# EAGLE design SPin (EAGLE 9.4.2)
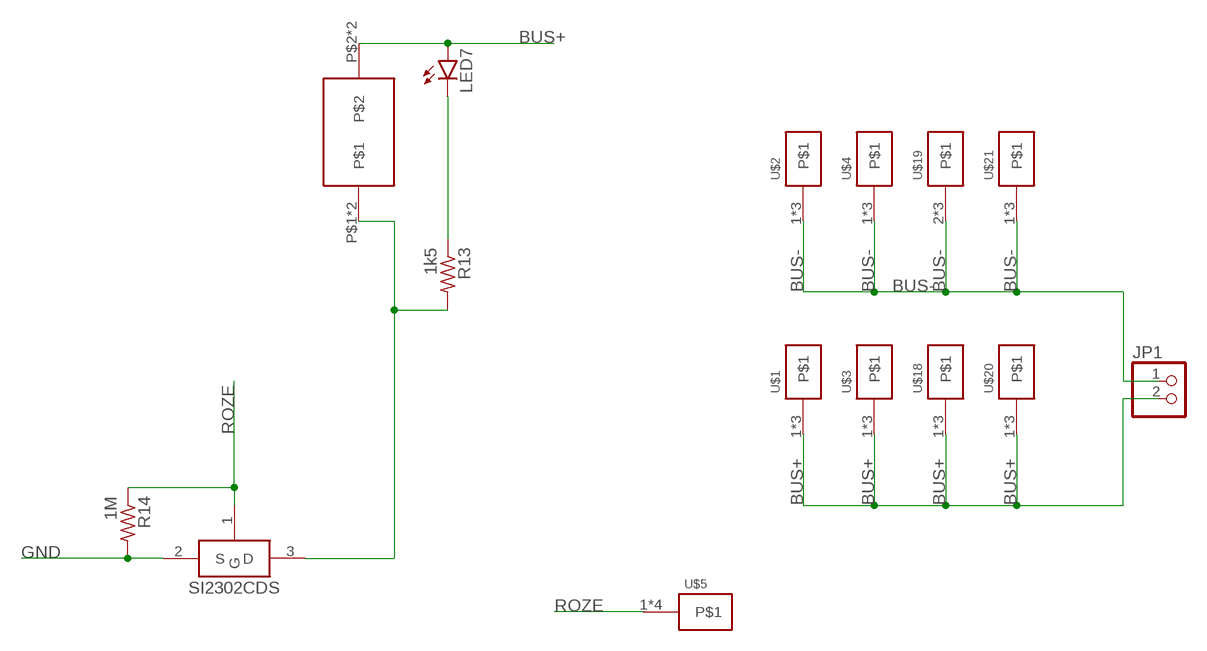
[diagram p0: schematic, sheet 1]

## Parts
JP1  PINHD-1X2  [1X02]
LED7  LEDCHIPLED_0603  [CHIPLED_0603]
R13  1k5  R-US_R0603  [R0603]
R14  1M  R-US_R0603  [R0603]
U$1  KCONNECT3  [KCONNECT-3]
U$2  KCONNECT3  [KCONNECT-3]
U$3  KCONNECT4  [KCONNECT-4]
U$4  KCONNECT4  [KCONNECT-4]
U$5  KCONNECTQUAD-  [KCONNECT-_QUAD]
U$6  GRAFITGRAFIT4_2  [GRAFIT4_2]
U$13  SI2302CDS  [SOT23-3]
U$18  KCONNECT4  [KCONNECT-4]
U$19  KCONNECT1  [KCONNECT-1]
U$20  KCONNECT3  [KCONNECT-3]
U$21  KCONNECT3  [KCONNECT-3]

## Nets
2: R13.2 U$6.P$1 U$6.P$4 U$13.3(D)
BUS+: JP1.2 LED7.A U$1.1 U$1.2 U$1.4 U$3.1 U$3.2 U$3.3 U$6.P$2 U$6.P$5 U$18.1 U$18.2 U$18.3 U$20.1 U$20.2 U$20.4
BUS-: JP1.1 U$2.1 U$2.2 U$2.4 U$4.1 U$4.2 U$4.3 U$19.2 U$19.3 U$19.4 U$21.1 U$21.2 U$21.4
GND: R14.2 U$13.2(S)
N$29: LED7.C R13.1
ROZE: R14.1 U$5.1 U$5.2 U$5.3 U$5.4 U$13.1(G)

## Library data of the parts
JP1 = pinhead:PINHD-1X2: PIN HEADER
LED7 = led:LED: LED OSRAM: - CHIPLED LG R971, LG N971, LY N971, LG Q971, LY Q971, LO R971, LY R971 LH N974, LH R974 LS Q976, LO Q976, LY Q976 LO Q996 - Hyper CHIPLED LW Q18S LB Q993, LB Q99A, LB R99A - SideLED LS A670, LO A670, LY A670, LG A670, LP A670 LB A673, LV A673, LT A673, LW A673 LH A674 LY A675 LS A676, LA A676, LO A676, LY A676, LW A676 LS A679, LY A679, LG A679 - Hyper Micro SIDELED® LS Y876, LA Y876, LO Y876, LY Y876 LT Y87S - SmartLED LW L88C, LW L88S LB L89C, LB L89S, LG L890 LS L89K, LO L89K, LY L89K LS L896, LA L896, LO L896, LY L896 - TOPLED LS T670, LO T670, LY T670, LG T670, LP T670 LSG T670, LSP T670, LSY T670, LOP T670, LYG T670 LG T671, LOG T671, LSG T671 LB T673, LV T673, LT T673, LW T673 LH T674 LS T676, LA T676, LO T676, LY T676, LB T676, LH T676, LSB T676, LW T676 LB T67C, LV T67C, LT T67C, LS T67K, LO T67K, LY T67K, LW E67C LS E67B, LA E67B, LO E67B, LY E67B, LB E67C, LV E67C, LT E67C LW T67C LS T679, LY T679, LG T679 LS T770, LO T770, LY T770, LG T770, LP T770 LB T773, LV T773, LT T773, LW T773 LH T774 LS E675, LA E675, LY E675, LS T675 LS T776, LA T776, LO T776, LY T776, LB T776 LHGB T686 LT T68C, LB T68C - Hyper Mini TOPLED® LB M676 - Mini TOPLED Santana® LG M470 LS M47K, LO M47K, LY M47K Source: http://www.osram.convergy.de LUXEON: - LUMILED® LXK2-PW12-R00, LXK2-PW12-S00, LXK2-PW14-U00, LXK2-PW14-V00 LXK2-PM12-R00, LXK2-PM12-S00, LXK2-PM14-U00 LXK2-PE12-Q00, LXK2-PE12-R00, LXK2-PE12-S00, LXK2-PE14-T00, LXK2-PE14-U00 LXK2-PB12-K00, LXK2-PB12-L00, LXK2-PB12-M00, LXK2-PB14-N00, LXK2-PB14-P00, LXK2-PB14-Q00 LXK2-PR12-L00, LXK2-PR12-M00, LXK2-PR14-Q00, LXK2-PR14-R00 LXK2-PD12-Q00, LXK2-PD12-R00, LXK2-PD12-S00 LXK2-PH12-R00, LXK2-PH12-S00 LXK2-PL12-P00, LXK2-PL12-Q00, LXK2-PL12-R00 Source: www.luxeon.com KINGBRIGHT: KA-3528ASYC Source: www.kingbright.com
R13 R14 = resistor:R-US_: RESISTOR, American symbol
U$1-U$5 U$18-U$21 = CanCubeSat:KCONNECT
U$6 = CanCubeSat:GRAFIT
U$13 = CanCubeSat:SI2302CDS

## Board
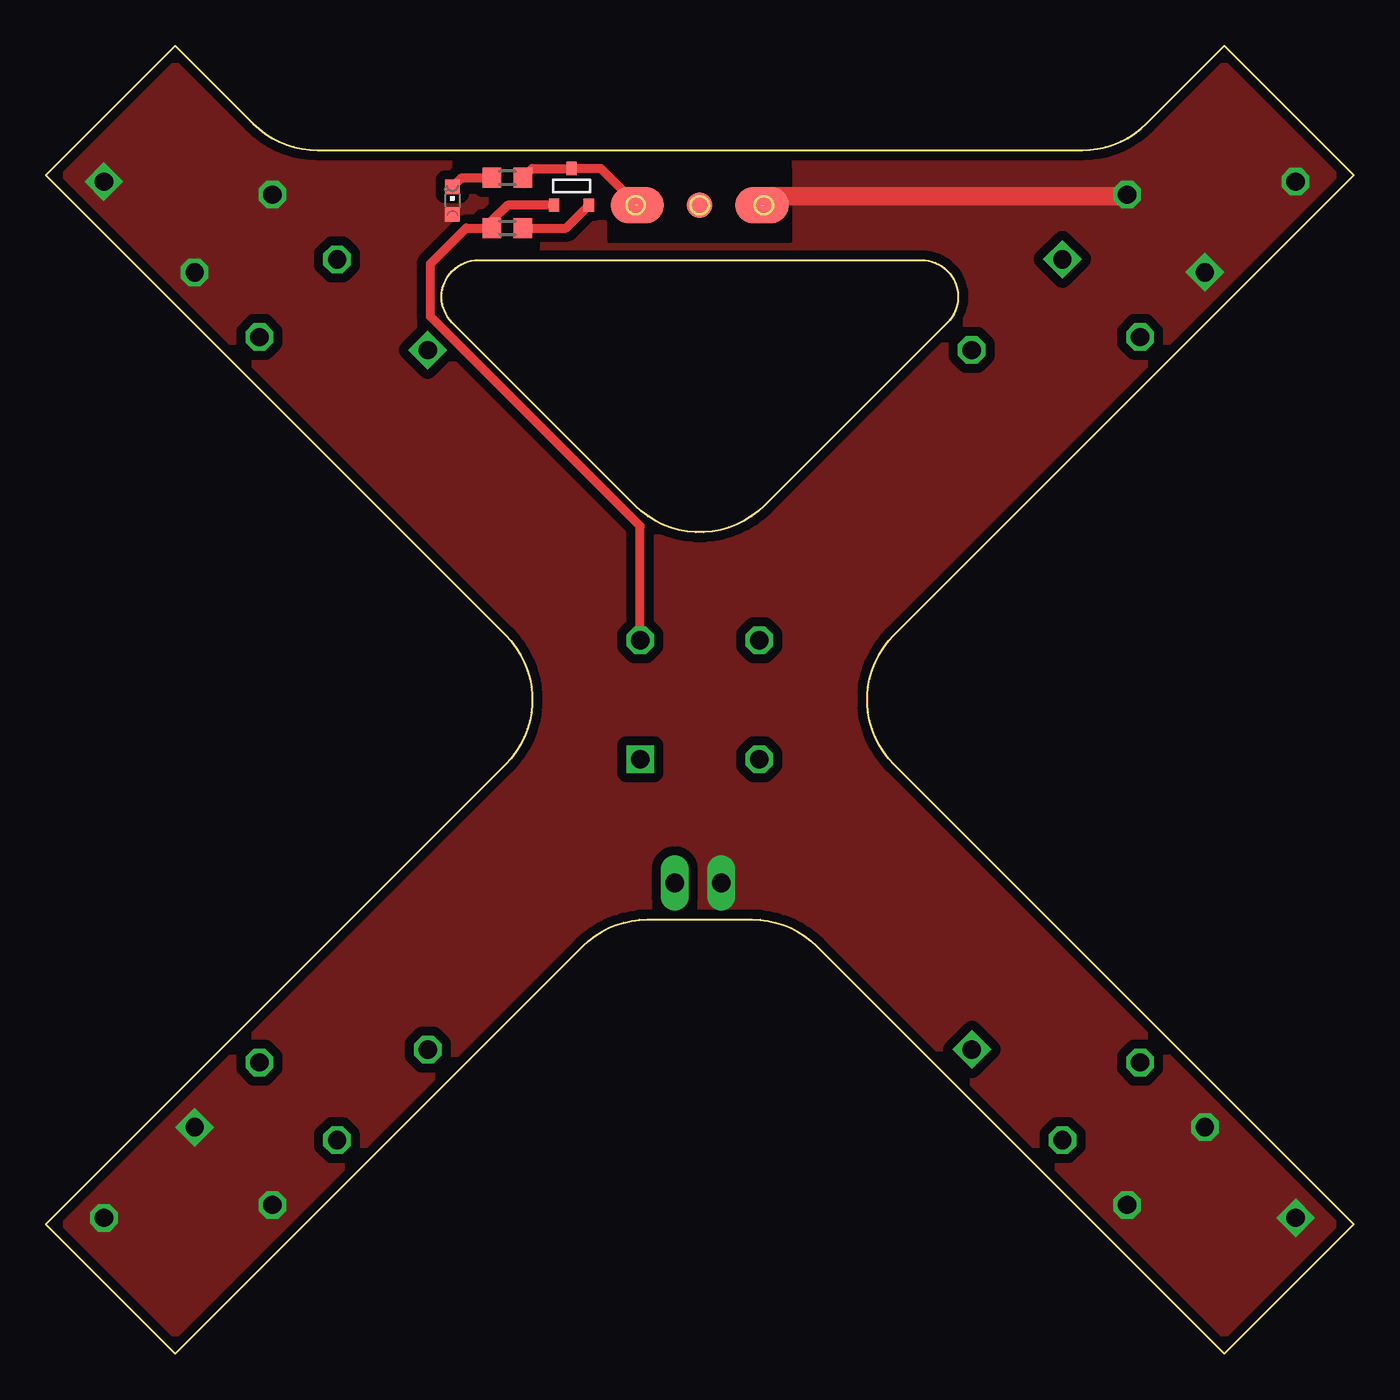
[diagram p1: board, top side]
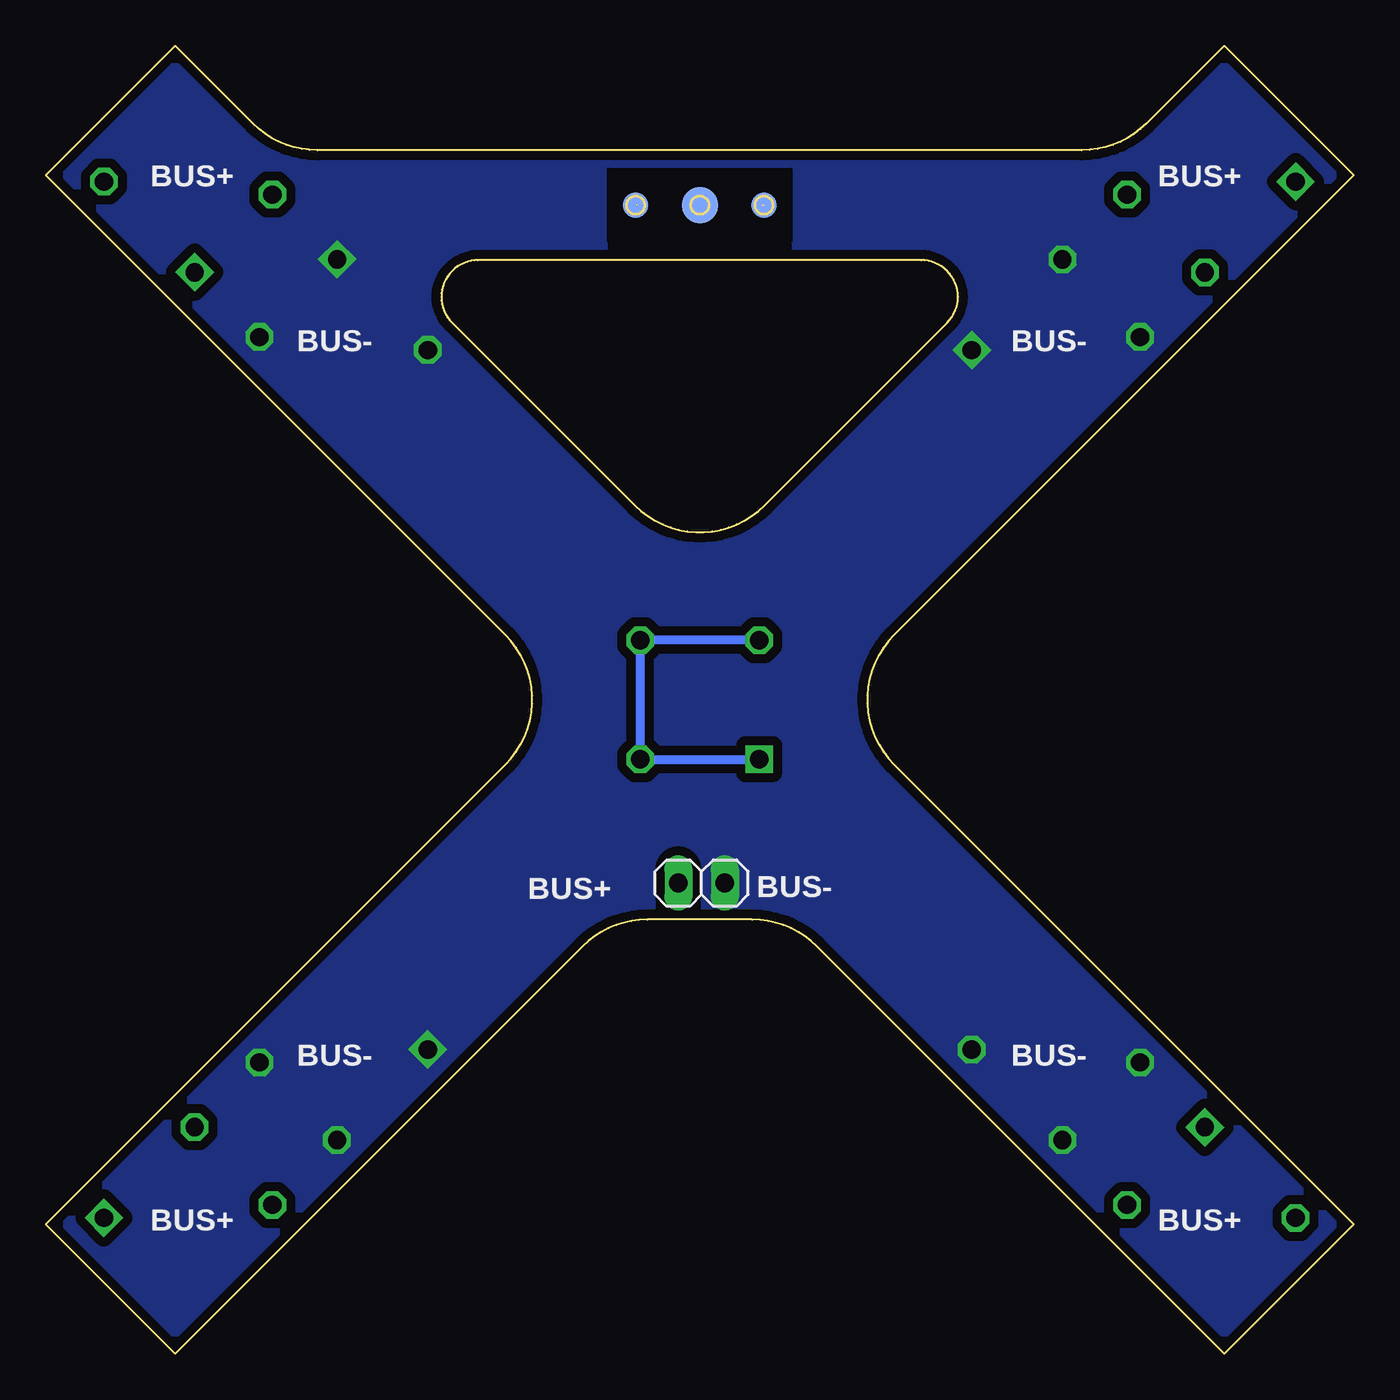
[diagram p2: board, bottom side, seen from below]

Size 71.4 x 71.4 mm. Coordinates in mm from the lower left corner, seen from the top.
Outline: 0,7.07 25.09,32.17 arc90 25.09,39.24 0,64.33 7.07,71.4 11.32,67.16 arc45 14.85,65.7 56.56,65.7 arc45 60.1,67.17 64.33,71.4 71.4,64.33 46.31,39.24 arc90 46.31,32.17 71.4,7.07 64.33,0 42.09,22.24 arc45 38.56,23.7 32.84,23.7 arc45 29.31,22.24 7.07,0 0,7.07
Outline: 32.17,46.31 22.19,56.29 arc-135 23.61,59.7 47.81,59.7 arc-135 49.22,56.28 39.24,46.31 arc-90 32.17,46.31
Copper layers (1*16): Top 0.035mm / dielectric 1.5mm / Bottom 0.035mm
Design rules "default *": minimum track width 0.3mm, minimum drill 0.35mm, track to track 0.22mm, track to pad 0.22mm, pad to pad 0.22mm, via to via 0.22mm, smd to smd 0.22mm, copper to edge 0.3mm, drill to drill 8mil, minimum pad ring 0.25mm, minimum via ring 0.25mm, stop-mask expansion 2mil, vias tented up to drill 0mil, thermal gap 10mil

### Footprints (pad centres in the part's own frame; a part is rotated, then mirrored left to right if it is on the bottom)
1X02 = drill 1.016 long: 1 -1.27,0; 2 1.27,0
CHIPLED_0603 = smd 0.8 x 0.8: A 0,-0.75; C 0,0.75
R0603 = smd 1 x 1.1: 1 -0.85,0; 2 0.85,0
KCONNECT-3 = drill 1 pad 1.4 square: 1 -3,-3.5 | drill 1 pad 1.4 octagon: 2 -3,3.5; 4 3,3.5
KCONNECT-4 = drill 1 pad 1.4 square: 1 -3,-3.5 | drill 1 pad 1.4 octagon: 2 -3,3.5; 3 3,-3.5
KCONNECT-_QUAD = drill 1 pad 1.4 square: 1 -3.25,-3.25 | drill 1 pad 1.4 octagon: 2 -3.25,3.25; 3 3.25,-3.25; 4 3.25,3.25
GRAFIT4_2 = smd 2 x 2 bottom: OUT 0,0 | smd 2 x 2.9: P$1 0,3.4; P$2 0,-3.4 | smd 1.4 x 1.4: P$3 0,0 | smd 1.4 x 1.4 bottom: P$4 0,3.5; P$5 0,-3.5
SOT23-3 = smd 0.56 x 0.73: 1 -0.95,-1; 2 0.95,-1; 3 0,1
KCONNECT-1 = drill 1 pad 1.4 octagon: 2 -3,3.5; 3 3,-3.5; 4 3,3.5

### Placement (x,y rotation side)
JP1  35.6,25.7 180 bottom
LED7  22.2,62.95 0 top
R13  25.2,64.2 0 top
R14  25.2,61.45 0 top
U$1  7.77,63.63 135 bottom
U$2  16.26,55.15 315 bottom
U$3  63.63,63.63 45 bottom
U$4  55.15,55.15 225 bottom
U$5  35.7,35.7 0 top
U$6  35.7,62.7 90 top
U$13  28.7,63.7 0 top
U$18  7.77,7.77 225 bottom
U$19  16.26,16.26 225 bottom
U$20  63.63,7.77 315 bottom
U$21  55.15,16.26 135 bottom

### Tracks (layer width: path | path; a pad name or v marks a point on that pad's centre or on a via)
2  (1 unrouted)
  Top 0.5: R13.2 26.55,64.7 U$13.3 30.3,64.7 U$6.P$1
BUS+  (1 unrouted)
  Top 1: U$3.3 58.96,63.2 39.6,63.2 U$6.P$2
  pour Top (isolate 0.5, no thermals): 71.7,0.2 71.7,71.1 0.3,71.1 0.3,0.2
  cutout Top: 30.7,64.7 30.7,60.7 40.7,60.7 40.7,64.7
BUS-
  pour Bottom (isolate 0.5, no thermals): 0.4,0.3 71.7,0.3 71.7,71.3 0.4,71.3
  cutout Bottom: 30.7,64.7 30.7,60.7 40.7,60.7 40.7,64.7
GND
  Top 0.5: R14.2 28.4,61.45 U$13.2
N$29
  Top 0.5: LED7.C 22.7,64.2 R13.1
ROZE
  Top 0.5: U$5.2 32.45,45.17 21,56.62 21,59.5 22.95,61.45 R14.1 24.35,61.85 25.2,62.7 U$13.1
  Bottom 0.5: U$5.2 U$5.4 U$5.3 U$5.1

### Text on the board
bNames: BUS+ | BUS+ | BUS- | BUS- | BUS- | BUS+ | BUS- | BUS- | BUS+ | BUS+